# Altium schematic sheet BOWIE_IMU.SchDoc
size A3; SheetNumber: 5; SheetTotal: 8
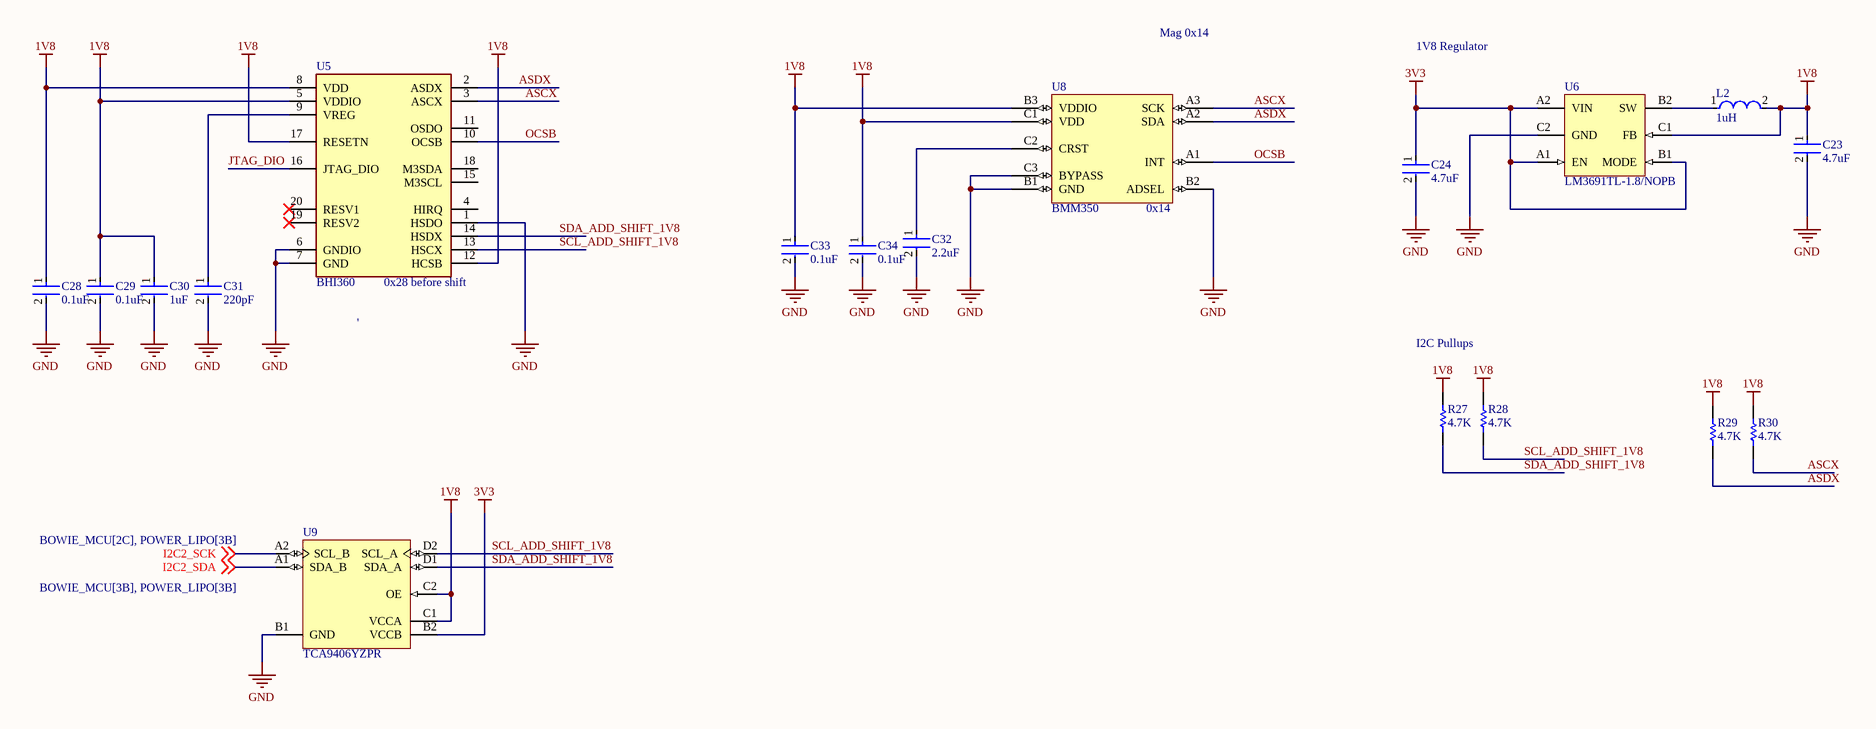
[diagram p0: BOWIE_IMU.SchDoc]

## Parts
C23  4.7uF  [FP-CL828-IPC_C]
C24  4.7uF  [FP-CL828-IPC_C]
C28  0.1uF  [FP-GRM033-0_03-IPC_C]
C29  0.1uF  [FP-GRM033-0_03-IPC_C]
C30  1uF  [FP-GRM033-0_05-e01_0_2-IPC_C]
C31  220pF  [FP-GRM033-0_03-IPC_C]
C32  2.2uF  [FP-GRM033-0_09-IPC_B]
C33  0.1uF  [FP-GRM033-0_03-IPC_C]
C34  0.1uF  [FP-GRM033-0_03-IPC_C]
L2  1uH  [FP-DFE18SAN_E0-MFG]
R27  4.7K  [RESC0603X26X15NL03T05]
R28  4.7K  [RESC0603X26X15NL03T05]
R29  4.7K  [RESC0603X26X15NL03T05]
R30  4.7K  [RESC0603X26X15NL03T05]
U5  BHI360  [BHI360]
U6  LM3691TL-1.8/NOPB  [YZR0006APAF]
U8  BMM350  [BMM350]
U9  TCA9406YZPR  [YZP0008ADAD]

## Nets
1V8: C23.1 C28.1 C29.1 C30.1 C33.1 C34.1 L2.2 R27.2 R28.2 R29.2 R30.2 U5.5(VDDIO) U5.8(VDD) U5.12(HCSB) U5.17(RESETN) U6.C1(FB) U8.B3(VDDIO) U8.C1(VDD) U9.C1(VCCA) U9.C2(OE)
3V3: C24.1 U6.A1(EN) U6.A2(VIN) U6.B1(MODE) U9.B2(VCCB)
GND: C23.2 C24.2 C28.2 C29.2 C30.2 C31.2 C32.2 C33.2 C34.2 U5.1(HSDO) U5.6(GNDIO) U5.7(GND) U6.C2(GND) U8.B1(GND) U8.B2(ADSEL) U8.C3(BYPASS) U9.B1(GND)
ASCX: R30.1 U5.3(ASCX) U8.A3(SCK)
ASDX: R29.1 U5.2(ASDX) U8.A2(SDA)
I2C2_SCK: U9.A2(SCL_B) ; off-sheet I2C2_SCK
I2C2_SDA: U9.A1(SDA_B) ; off-sheet I2C2_SDA
JTAG_DIO: U5.16(JTAG_DIO)
OCSB: U5.10(OCSB) U8.A1(INT)
SCL_ADD_SHIFT_1V8: R28.1 U5.13(HSCX) U9.D2(SCL_A)
SDA_ADD_SHIFT_1V8: R27.1 U5.14(HSDX) U9.D1(SDA_A)
NetC31_1: C31.1 U5.9(VREG)
NetC32_1: C32.1 U8.C2(CRST)
NetL2_1: L2.1 U6.B2(SW)

Not connected (* = marked no-connect by the designer): U5 4(HIRQ) 11(OSDO) 15(M3SCL) 18(M3SDA) 19(RESV2)* 20(RESV1)*

## Notes on the sheet
- Mag 0x14
- 1V8 Regulator
- (near U8) 0x14
- '
- (near U5) 0x28 before shift
- I2C Pullups

## Library data of the parts
C23 C24 = CMP-13271-001251-1: Cap Ceramic 4.7uF 10V X5R ±10% SMD 0402 +85°C Paper T/R; Height: 0.5mm; Mount: Surface Mount; Case Code (Metric): 1005; Case/Package: 0402; Capacitance: 4.7uF; Packaging: Tape and Reel; Dielectric: X5R; Radiation Hardening: No; Material: Ceramic; Thickness: 0.022inch; Min Operating Temperature: -55°C; Voltage Rating: 10V; Case Code (Imperial): 0402; Width: 0.02inch; Length: 1mm; Max Operating Temperature: 85°C; Lead Free: Lead Free; Tolerance: 10%; Package Quantity: 1; Depth: 0.5mm
C28 C29 C33 C34 = CMP-2010-01264-2: Chip Multilayer Ceramic Capacitors for General Purpose, 0201, 0.10uF, X5R, 15%, 10%, 10V; Capacitance: 100nF; Mount: Surface Mount; Dielectric: X5R; Width: 0.012inch; Tolerance: 10%; Radiation Hardening: No; Voltage Rating: 10V; REACH SVHC: No SVHC; Height: 0.3mm; Max Operating Temperature: 85°C; Voltage Rating (DC): 10V; Thickness: 0.013inch; Termination: SMD/SMT; Lead Free: Lead Free; Package Quantity: 1; Case/Package: 0201; Min Operating Temperature: -55°C; Weight: 6E-06oz; Length: 0.6mm; Case Code (Imperial): 0201; Depth: 0.3mm; Voltage: 10V; Packaging: Tape and Reel; Case Code (Metric): 0603
C30 = CMP-06035-049957-1: Chip Multilayer Ceramic Capacitors for General Purpose, 0201, 1.0uF, X5R, 15%, 20%, 4V; Case Code (Metric): 0603; Height: 0.3mm; Packaging: Tape and Reel; Case/Package: 0201; Voltage Rating: 4V; Case Code (Imperial): 0201; Min Operating Temperature: -55°C; Length: 0.024inch; Package Quantity: 15000; Voltage Rating (DC): 4V; Dielectric: X5R; Thickness: 0.014inch; Termination: SMD/SMT; Tolerance: 20%; Max Operating Temperature: 85°C; Mount: Surface Mount; Width: 0.012inch; Capacitance: 1uF; Weight: 1.2E-05oz
C31 = CMP-2010-01692-2: Chip Multilayer Ceramic Capacitors for General Purpose, 0201, 220pF, X7R, 15%, 10%, 16V; Radiation Hardening: No; Tolerance: 10%; Depth: 0.3mm; Height: 0.3mm; Lead Free: Lead Free; Voltage Rating (DC): 16V; Case Code (Metric): 0603; Capacitance: 220pF; Termination: SMD/SMT; Mount: Surface Mount; Width: 0.012inch; Case Code (Imperial): 0201; Min Operating Temperature: -55°C; Thickness: 0.013inch; Case/Package: 0201; Voltage Rating: 16V; Dielectric: X7R; Length: 0.6mm; Max Operating Temperature: 125°C; Package Quantity: 15000; Packaging: Tape and Reel
C32 = CMP-06035-032992-1: Chip Multilayer Ceramic Capacitors for General Purpose, 0201, 2.2uF, X5R, 15%, 10%, 10V; Min Operating Temperature: -55°C; Case/Package: 0201; Capacitance: 2.2uF; Dielectric: X5R; Case Code (Metric): 0603; Width: 0.012inch; Voltage Rating: 10V; Length: 0.024inch; Packaging: Tape and Reel; Case Code (Imperial): 0201; Mount: Surface Mount; Tolerance: 10%; Voltage Rating (DC): 10V; Max Operating Temperature: 85°C; Thickness: 0.015inch
L2 = CMP-06042-016331-1: FIXED IND 1UH 1.6A 144 MOHM SMD; Saturation Current: 2A; DC Resistance (DCR): 144mR; Shielding: Shielded; Core Material: Metal; Tolerance: 20%; Test Frequency: 1MHz; Mount: Surface Mount; Min Operating Temperature: -40°C; Current Rating: 1.6A; Case Code (Imperial): 0603; Inductance: 1uH; RoHS Compliant: Yes; Max Operating Temperature: 85°C; Case/Package: 0603; Packaging: Cut Tape; Case Code (Metric): 1608
R27-R30 = CMP-2004-02966-1: Part Number: ERJ-1GEF4701C; Manufacturer: Panasonic
U5 = BHI360: IMUs - Inertial Measurement Units Programmable smart sensor combining accelerometer, gyroscope and fusion software; Manufacturer_Name: BOSCH; Geometry.Height: 1mm; Mouser Part Number: 262-BHI360; Mouser Price/Stock: https://www.mouser.co.uk/ProductDetail/Bosch-Sensortec/BHI360?qs=ulEaXIWI0c93cz3Dqv%252BGgg%3D%3D; Manufacturer_Part_Number: BHI360; Datasheet Link: https://www.bosch-sensortec.com/media/boschsensortec/downloads/datasheets/bst-bhi360-ds000.pdf
U6 = CMP-0063-00271-3: High Accuracy, Miniature 1A, Step-Down DC-DC Converter for Portable Applications, 6-pin Micro SMD, Pb-Free; Manufacturer: Texas Instruments; PackageTopMarking: XV*I Z; CompType: MiscPower; High-Reliability: Y; PinCount: 6; PartNumber: LM3691TL-1.8/NOPB; PackageDescription: Thin Micro SMD, 6 Bump (Large), 0.5mm Pitch; RoHS: Y; PackageReference: YZR0006APAF; ComponentLink1URL: http://www.ti.com/general/docs/lit/getliterature.tsp?genericPartNumber=LM3691&fileType=pdf; Code_JEDEC: MO-211-DB; ComponentLink1Description: Datasheet URL; PowerWise: Y
U9 = CMP-0314-00005-2: TCA9406 Dual Bidirectional 1-MHz I2C-BUS and SMBus Voltage Level-Translator, 1.65 to 3.6 V, -40 to 85 degC, 8-pin DSBGA (YZP), Green (RoHS & no Sb/Br); Manufacturer: Texas Instruments; SubFamily: I2C Special Function; Push-Pull I/O Type: Yes; Max Frequency(kHz): 1000; No. of Outputs: 2; Function: I2C Voltage Level Translator; VCC(Min)(V): -0.5; VCC(Max)(V): 4.6; Rating: Catalog; PartNumber: TCA9406YZPR; PackageReference: YZP0008ADAD; Eco-Plan: Green (RoHS & no Sb/Br); ComponentLink1Description: Datasheet; PackageDescription: 8-Ball Die-Size Ball Grid Array, 1.9 x 0.9 mm Body, 0.5 mm Pitch, Pb-Free; On-Chip Power-on-Reset: No; DatasheetVersion: SCPS221; Mounting Technology: Surface Mount; PackageVersion: revI, Feb-2012; Vcc range(V): 1.65 to 3.6; ComponentLink1URL: http://www.ti.com/general/docs/lit/getliterature.tsp?genericPartNumber=TCA9406&fileType=pdf; 5V Tolerant I/O: Yes; ComponentLink2Description: Package Specification; Enable Pin: Yes; ComponentLink2URL: http://www.ti.com/litv/pdf/msoi002j; Open Drain I/O Type: Yes